# EAGLE schematic Power88 (EAGLE 9.1.3)

## Sheet 1 of 2: TX
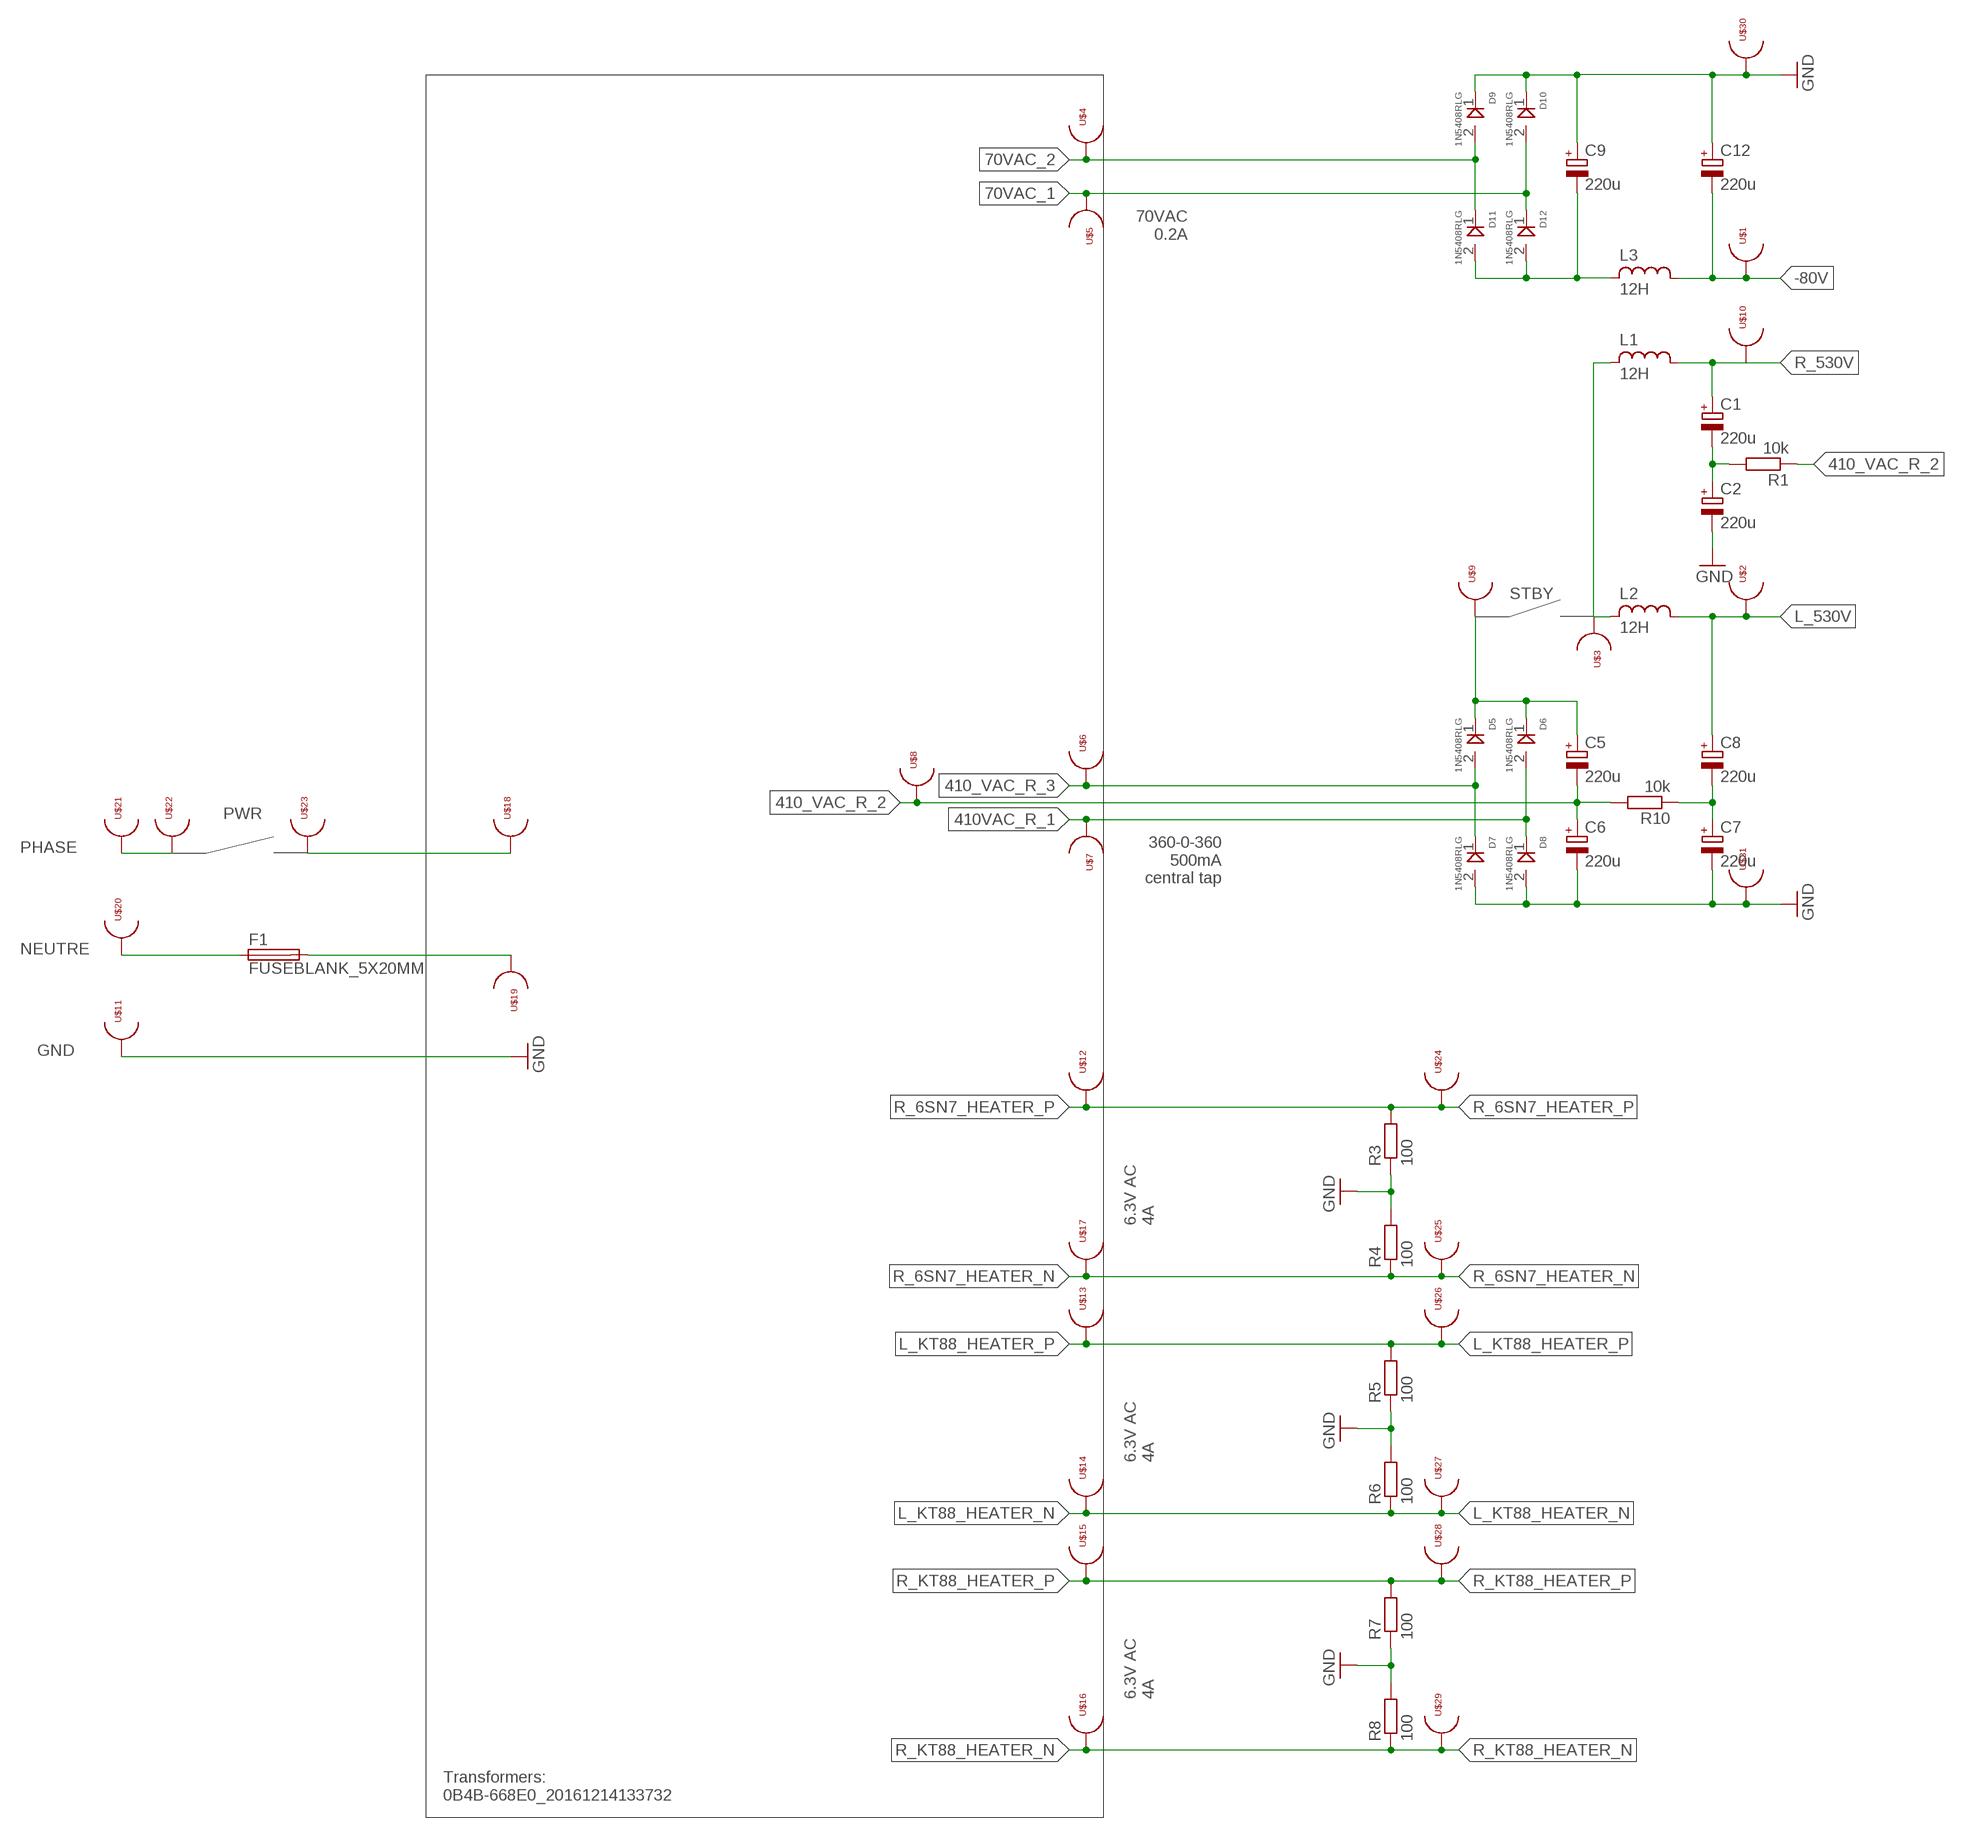
[diagram p0: schematic, sheet 1]

### Parts
C1  220u  CPOL-EUE7.5-16  [E7,5-16]
C2  220u  CPOL-EUE7.5-16  [E7,5-16]
C5  220u  CPOL-EUE7.5-16  [E7,5-16]
C6  220u  CPOL-EUE7.5-16  [E7,5-16]
C7  220u  CPOL-EUE7.5-16  [E7,5-16]
C8  220u  CPOL-EUE7.5-16  [E7,5-16]
C9  220u  CPOL-EUE7.5-16  [E7,5-16]
C12  220u  CPOL-EUE7.5-16  [E7,5-16]
D5  1N5408RLG  [DIOAD2860W130L840D505]
D6  1N5408RLG  [DIOAD2860W130L840D505]
D7  1N5408RLG  [DIOAD2860W130L840D505]
D8  1N5408RLG  [DIOAD2860W130L840D505]
D9  1N5408RLG  [DIOAD2860W130L840D505]
D10  1N5408RLG  [DIOAD2860W130L840D505]
D11  1N5408RLG  [DIOAD2860W130L840D505]
D12  1N5408RLG  [DIOAD2860W130L840D505]
F1  FUSEBLANK_5X20MM  [FUSE_HOLDER_5X20MM]
L1  12H  RL622  [RL622]
L2  12H  RL622  [RL622]
L3  12H  RL622  [RL622]
R1  10k  R-EU_R1206  [R1206]
R3  100  R-EU_R1206  [R1206]
R4  100  R-EU_R1206  [R1206]
R5  100  R-EU_R1206  [R1206]
R6  100  R-EU_R1206  [R1206]
R7  100  R-EU_R1206  [R1206]
R8  100  R-EU_R1206  [R1206]
R10  10k  R-EU_R1206  [R1206]
U$1  TESTPOINT_HOLE  [TESTPOINT_PHOLE]
U$2  TESTPOINT_HOLE  [TESTPOINT_PHOLE]
U$3  TESTPOINT_HOLE  [TESTPOINT_PHOLE]
U$4  TESTPOINT_HOLE  [TESTPOINT_PHOLE]
U$5  TESTPOINT_HOLE  [TESTPOINT_PHOLE]
U$6  TESTPOINT_HOLE  [TESTPOINT_PHOLE]
U$7  TESTPOINT_HOLE  [TESTPOINT_PHOLE]
U$8  TESTPOINT_HOLE  [TESTPOINT_PHOLE]
U$9  TESTPOINT_HOLE  [TESTPOINT_PHOLE]
U$10  TESTPOINT_HOLE  [TESTPOINT_PHOLE]
U$11  TESTPOINT_HOLE  [TESTPOINT_PHOLE]
U$12  TESTPOINT_HOLE  [TESTPOINT_PHOLE]
U$13  TESTPOINT_HOLE  [TESTPOINT_PHOLE]
U$14  TESTPOINT_HOLE  [TESTPOINT_PHOLE]
U$15  TESTPOINT_HOLE  [TESTPOINT_PHOLE]
U$16  TESTPOINT_HOLE  [TESTPOINT_PHOLE]
U$17  TESTPOINT_HOLE  [TESTPOINT_PHOLE]
U$18  TESTPOINT_HOLE  [TESTPOINT_PHOLE]
U$19  TESTPOINT_HOLE  [TESTPOINT_PHOLE]
U$20  TESTPOINT_HOLE  [TESTPOINT_PHOLE]
U$21  TESTPOINT_HOLE  [TESTPOINT_PHOLE]
U$22  TESTPOINT_HOLE  [TESTPOINT_PHOLE]
U$23  TESTPOINT_HOLE  [TESTPOINT_PHOLE]
U$24  TESTPOINT_HOLE  [TESTPOINT_PHOLE]
U$25  TESTPOINT_HOLE  [TESTPOINT_PHOLE]
U$26  TESTPOINT_HOLE  [TESTPOINT_PHOLE]
U$27  TESTPOINT_HOLE  [TESTPOINT_PHOLE]
U$28  TESTPOINT_HOLE  [TESTPOINT_PHOLE]
U$29  TESTPOINT_HOLE  [TESTPOINT_PHOLE]
U$30  TESTPOINT_HOLE  [TESTPOINT_PHOLE]
U$31  TESTPOINT_HOLE  [TESTPOINT_PHOLE]

### Nets
70VAC_1: D10.2(A) D12.1(K) U$5.P$1
70VAC_2: D9.2(A) D11.1(K) U$4.P$1
410_VAC_R_2: C5.- C6.+ R1.1 R10.2 U$8.P$1
410_VAC_R_3: D5.2(A) D7.1(K) U$6.P$1
410VAC_R_1: D6.2(A) D8.1(K) U$7.P$1
530V: C5.+ D5.1(K) D6.1(K) U$9.P$1
-80V: C12.- L3.2 U$1.P$1
AC_PLUG_N: F1.1 U$20.P$1
AC_PLUG_PHASE: U$21.P$1 U$22.P$1
GND: C2.- C6.- C7.- C9.+ C12.+ D7.2(A) D8.2(A) D9.1(K) D10.1(K) R3.1 R4.2 R5.1 R6.2 R7.1 R8.2 U$11.P$1 U$30.P$1 U$31.P$1
L_530V: C8.+ L2.2 U$2.P$1
L_KT88_HEATER_N: R6.1 U$14.P$1 U$27.P$1
L_KT88_HEATER_P: R5.2 U$13.P$1 U$26.P$1
N$1: C7.+ C8.- R10.1
N$2: L1.1 L2.1 U$3.P$1
N$4: C1.- C2.+ R1.2
N$6: F1.2 U$19.P$1
N$40: C9.- D11.2(A) D12.2(A) L3.1
R_6SN7_HEATER_N: R4.1 U$17.P$1 U$25.P$1
R_6SN7_HEATER_P: R3.2 U$12.P$1 U$24.P$1
R_530V: C1.+ L1.2 U$10.P$1
R_KT88_HEATER_N: R8.1 U$16.P$1 U$29.P$1
R_KT88_HEATER_P: R7.2 U$15.P$1 U$28.P$1
SW_ACIN: U$18.P$1 U$23.P$1

### Notes on the sheet
- 70VAC
  0.2A
- STBY
- PWR
- 360-0-360
  500mA
  central tap
- PHASE
- NEUTRE
- GND
- 6.3V AC
  4A
- 6.3V AC
  4A
- 6.3V AC
  4A
- Transformers:
  0B4B-668E0_20161214133732

## Sheet 2 of 2

## Library data of the parts
C1 C2 C5-C9 C12 = rcl:CPOL-EU: POLARIZED CAPACITOR, European symbol; RATING: 300V
D5-D12 = SamacSys_Parts:1N5408RLG: Source: Datasheet <http://www.onsemi.com/pub/Collateral/1N5400-D.PDF>; ALLIED_NUMBER: 70339244; ALLIED_PRICE/STOCK: http://www.alliedelec.com/on-semiconductor-1n5408rlg/70339244/; ARROW_PART_NUMBER: 1N5408RLG; ARROW_PRICE/STOCK: https://www.arrow.com/en/products/1n5408rlg/on-semiconductor; HEIGHT: mm; MANUFACTURER_NAME: ON Semiconductor; MANUFACTURER_PART_NUMBER: 1N5408RLG; RS_PART_NUMBER: 7925322P; RS_PRICE/STOCK: http://uk.rs-online.com/web/p/products/7925322P
F1 = fuse:FUSE: Fuse; OC_FARNELL: unknown; OC_NEWARK: unknown
L1-L3 = inductor-bourns:RL622: RF CHOKE; RATING: 200mA
R1 R3-R8 R10 = rcl:R-EU_: RESISTOR, European symbol
U$1-U$31 = test_points:TESTPOINT_HOLE